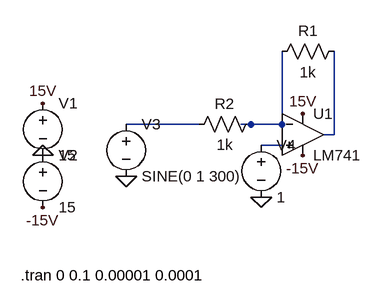
[diagram p0: schematic DCOffsett.asc]
DCOffsett.asc, the LTspice schematic file:
Version 4
SHEET 1 880 680
WIRE 192 96 80 96
WIRE 272 96 256 96
WIRE 320 96 320 -16
WIRE 320 96 272 96
WIRE 400 112 400 -16
WIRE 400 112 384 112
WIRE 320 128 288 128
FLAG -48 144 0
FLAG -48 64 15V
FLAG 352 80 15V
FLAG -48 224 -15V
FLAG 352 144 -15V
FLAG 288 208 0
FLAG 80 176 0
SYMBOL OpAmps\\LM741 352 48 R0
SYMATTR InstName U1
SYMBOL voltage -48 48 R0
WINDOW 123 0 0 Left 0
WINDOW 39 0 0 Left 0
SYMATTR InstName V1
SYMATTR Value 15
SYMBOL voltage -48 128 R0
WINDOW 123 0 0 Left 0
WINDOW 39 0 0 Left 0
SYMATTR InstName V2
SYMATTR Value 15
SYMBOL voltage 80 80 R0
WINDOW 123 0 0 Left 0
WINDOW 39 0 0 Left 0
SYMATTR InstName V3
SYMATTR Value SINE(0 1 300)
SYMBOL res 416 -32 R90
WINDOW 0 0 56 VBottom 2
WINDOW 3 32 56 VTop 2
SYMATTR InstName R1
SYMATTR Value 1k
SYMBOL res 288 80 R90
WINDOW 0 0 56 VBottom 2
WINDOW 3 32 56 VTop 2
SYMATTR InstName R2
SYMATTR Value 1k
SYMBOL voltage 288 112 R0
WINDOW 123 0 0 Left 0
WINDOW 39 0 0 Left 0
SYMATTR InstName V4
SYMATTR Value 1
TEXT -82 328 Left 2 !.tran 0 0.1 0.00001 0.0001

The netlist it stands for:
* DCOffsett.asc
XU1 N004 N002 15V -15V N003 LM741  ; pins In+ In- V+ V- OUT
V1 15V 0 15
V2 0 -15V 15
V3 N001 0 SINE(0 1 300)
R1 N003 N002 1k
R2 N002 N001 1k
V4 N004 0 1
.tran 0 0.1 0.00001 0.0001
.lib LM741.lib
.backanno
.end